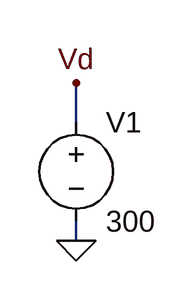
[diagram p0: schematic Draft1.asc]
Draft1.asc, the LTspice schematic file:
Version 4
SHEET 1 880 680
WIRE -32 96 -32 64
WIRE -32 192 -32 176
FLAG -32 192 0
FLAG -32 64 Vd
SYMBOL voltage -32 80 R0
WINDOW 123 0 0 Left 0
WINDOW 39 0 0 Left 0
SYMATTR InstName V1
SYMATTR Value 300

The netlist it stands for:
* Draft1.asc
V1 Vd 0 300
.backanno
.end